# Altium schematic sheet J2 Control Panel.SchDoc
size A4
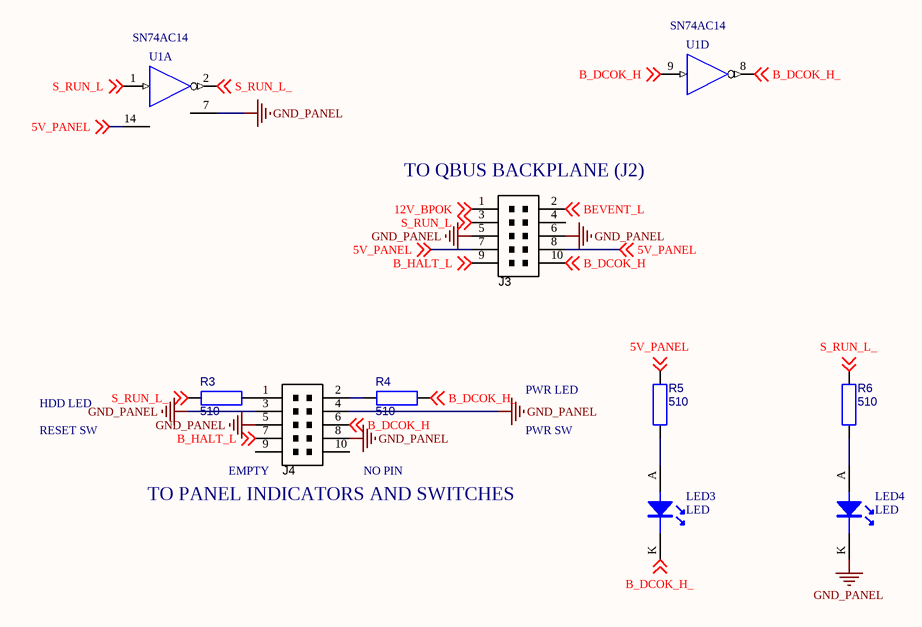
[diagram p0: J2 Control Panel.SchDoc]

## Parts
J3  shrouded box header  [10P_PCB_HEADER_BRD_MNT]  (value not drawn)
J4  shrouded box header  [10P_PCB_HEADER_BRD_MNT]  (value not drawn)
LED3  LED  [LTST-C170]  (no BOM)
LED4  LED  [LTST-C170]  (no BOM)
R3  510  [RESC2012X70N]  (no BOM)
R4  510  [RESC2012X70N]  (no BOM)
R5  510  [RESC2012X70N]  (no BOM)
R6  510  [RESC2012X70N]  (no BOM)
U1  SN74AC14  [J014C]  (parts A,D of 6)

## Nets
GND: U1.7(GND)
GND_PANEL: J3.5 J3.6 J4.3 J4.4 J4.5 J4.8 LED4.K U1.7(GND_PANEL)
VCC: U1.14(VCC)
5V_PANEL: J3.7 J3.8 R5.1 U1.14(VCC) ; off-sheet 5V_PANEL
12V_BPOK: J3.1 ; off-sheet 12V_BPOK
B_DCOK_H: J3.10 J4.6 U1.9(A) ; off-sheet B_DCOK_H
B_DCOK_H_: LED3.K R4.2 U1.8(Y) ; off-sheet B_DCOK_H_
B_HALT_L: J3.9 J4.7 ; off-sheet B_HALT_L
BEVENT_L: J3.2 ; off-sheet BEVENT_L
S_RUN_L: J3.3 U1.1(A) ; off-sheet S_RUN_L
S_RUN_L_: R3.1 R6.1 U1.2(Y) ; off-sheet S_RUN_L_
NetJ4_1: J4.1 R3.2
NetJ4_2: J4.2 R4.1
NetLED3_A: LED3.A R5.2
NetLED4_A: LED4.A R6.2

Not connected (* = marked no-connect by the designer): J3 4; J4 9 10

## Notes on the sheet
- (near J3) TO QBUS BACKPLANE (J2)
- HDD LED
- PWR LED
- RESET SW
- (near J4) EMPTY
- NO PIN
- PWR SW
- (near J4) TO PANEL INDICATORS AND SWITCHES

## Library data of the parts
J3 J4 = CONN_HEADER_2x5P_0.100in_Male: Header THD 10 POS Double-row 2.54mm pitch; Manufacturer 1: 3M; Manufacturer Part Number 1: D2510-6002-AR; Pitch: 0.100" (2.54mm); Value: Double-row, 10 positions; QtyOverride: 1; Connector Type: Header, Shrouded; Number of Positions: 10; SCDType: undef; P/N: 5103308-1; Package / Case: Connector header; 2.54mm pitch; Contact Type: Male Pin; Number of Rows: 2; Row Spacing: 0.100" (2.54mm); Contact Mating Length: 0.243" (6.17mm); ComponentLink1URL: http://multimedia.3m.com/mws/mediawebserver?66666UuZjcFSLXTtm8T_oxMcEVuQEcuZgVs6EVs6E666666--; ComponentLink1Description: http://multimedia.3m.com/mws/mediawebserver?66666UuZjcFSLXTtm8T_oxMcEVuQEcuZgVs6EVs6E666666--; Supplier 1: Digi-Key; Supplier Part Number 1: MHC10E-ND
LED3 LED4 = LED: Value: GREEN 0805 LED; P/N: LTST-C170TGKT
R3 R4 R6 = RES2: RESISTOR; P/N: CRCW0201510RJNED; Value: 510
R5 = RES2: RESISTOR; Value: CRCW0201510RJNED; P/N: CRCW0201510RJNED
U1 = SN74AHCT14D: Hex Schmitt-Trigger Inverter; P/N: SN74AC14N; Published: 8-Jun-2000; LatestRevisionDate: 13-Apr-2006; LatestRevisionNote: IPC-7351 Footprint Added.; DatasheetVersion: Apr-1999; PackageVersion: Jan-1998; PackageReference: D014; Publisher: Altium Limited; PackageDescription: 14-Pin Small Outline Integrated Circuit 1.27 mm Pitch; Code_IPC: SOIC127P600-14; ComponentLink1Description: Manufacturer Link; ComponentLink1URL: http://www.ti.com/; ComponentLink2Description: Datasheet; ComponentLink2URL: http://www-s.ti.com/sc/ds/sn74ahct14.pdf; ComponentLink3Description: Packaging Specification; ComponentLink3URL: http://focus.ti.com/lit/ml/mpds177/mpds177.pdf